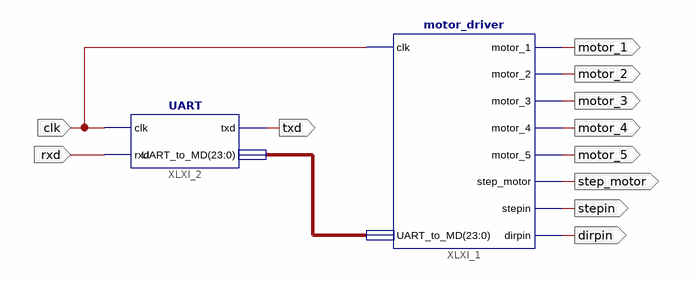
[diagram p0: schematic sheet 1]
// Xilinx ISE schematic Schematic.sch (spartan3e) as structural Verilog: 2 symbols, 11 ports
module Schematic (
  input  clk,
  input  rxd,
  output txd,
  output motor_1,
  output motor_2,
  output motor_3,
  output motor_4,
  output motor_5,
  output step_motor,
  output stepin,
  output dirpin
);

  wire [23:0] XLXN_2;

  motor_driver XLXI_1 (
    .clk(clk), .UART_to_MD(XLXN_2), .motor_1(motor_1), .motor_2(motor_2), .motor_3(motor_3),
    .motor_4(motor_4), .motor_5(motor_5), .step_motor(step_motor), .stepin(stepin), .dirpin(dirpin));
  UART XLXI_2 (.clk(clk), .rxd(rxd), .txd(txd), .UART_to_MD(XLXN_2));
endmodule
